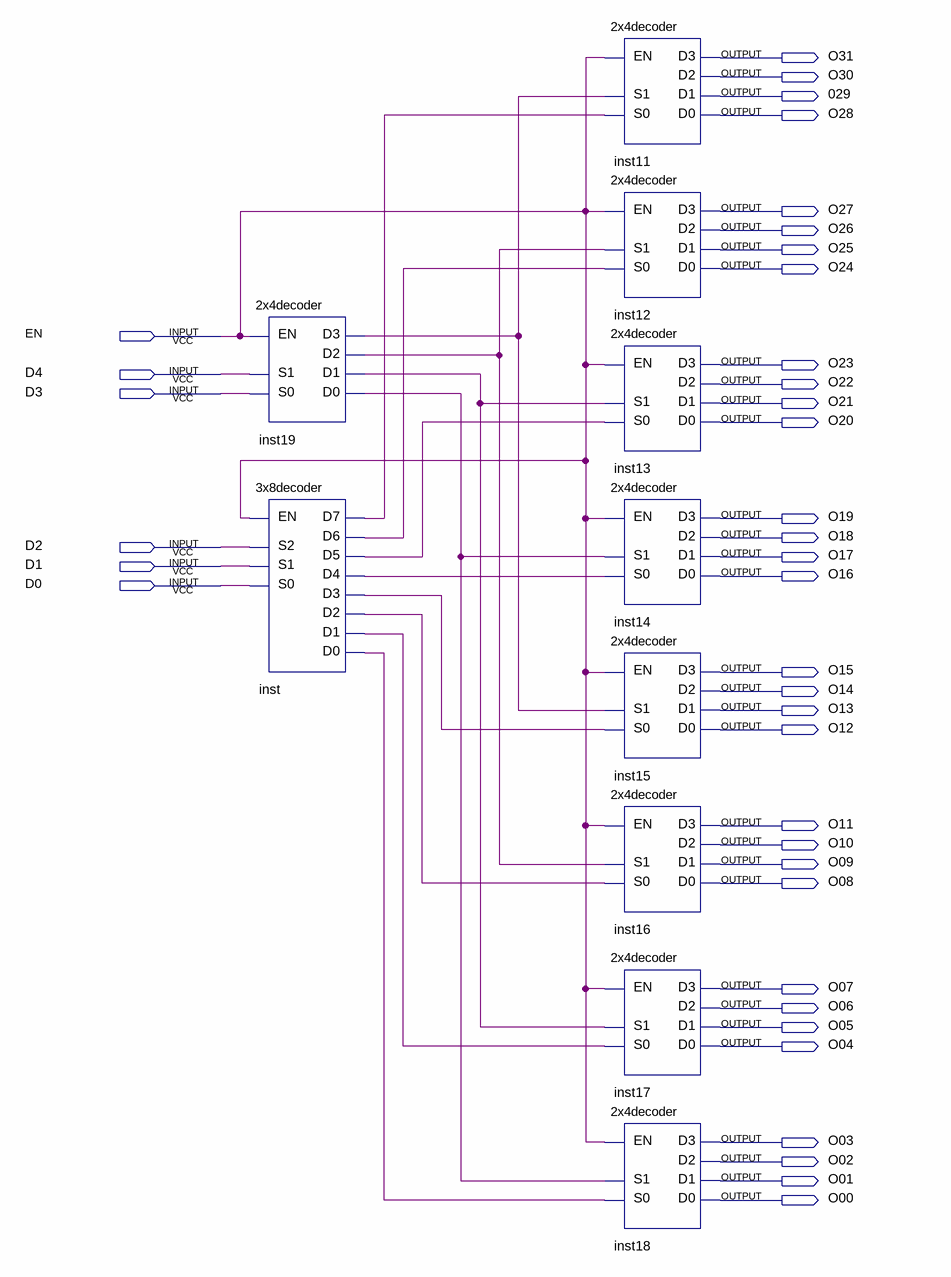
[diagram p0: schematic sheet]
// Quartus schematic hw6p1.bdf as structural Verilog: 10 symbols, 38 pins
module hw6p1 (
  input  EN,
  input  D4,
  input  D3,
  input  D2,
  input  D1,
  input  D0,
  output O31,
  output O30,
  output \029 ,
  output O28,
  output O27,
  output O26,
  output O25,
  output O24,
  output O23,
  output O22,
  output O21,
  output O20,
  output O19,
  output O18,
  output O17,
  output O16,
  output O15,
  output O14,
  output O13,
  output O12,
  output O11,
  output O10,
  output O09,
  output O08,
  output O07,
  output O06,
  output O05,
  output O04,
  output O03,
  output O02,
  output O01,
  output O00
);

  wire inst19_d0, inst19_d1, inst19_d2, inst19_d3, inst_d0, inst_d1, inst_d2, inst_d3, inst_d4, inst_d5,
       inst_d6, inst_d7;

  \2x4decoder  inst19 (.S1(D4), .S0(D3), .EN(EN), .D3(inst19_d3), .D2(inst19_d2), .D1(inst19_d1), .D0(inst19_d0));
  \3x8decoder  inst (
    .S2(D2), .S1(D1), .S0(D0), .EN(EN), .D7(inst_d7), .D6(inst_d6), .D5(inst_d5), .D4(inst_d4), .D3(inst_d3),
    .D2(inst_d2), .D1(inst_d1), .D0(inst_d0));
  \2x4decoder  inst11 (.S1(inst19_d3), .S0(inst_d7), .EN(EN), .D3(O31), .D2(O30), .D1(\029 ), .D0(O28));
  \2x4decoder  inst12 (.S1(inst19_d2), .S0(inst_d6), .EN(EN), .D3(O27), .D2(O26), .D1(O25), .D0(O24));
  \2x4decoder  inst13 (.S1(inst19_d1), .S0(inst_d5), .EN(EN), .D3(O23), .D2(O22), .D1(O21), .D0(O20));
  \2x4decoder  inst14 (.S1(inst19_d0), .S0(inst_d4), .EN(EN), .D3(O19), .D2(O18), .D1(O17), .D0(O16));
  \2x4decoder  inst15 (.S1(inst19_d3), .S0(inst_d3), .EN(EN), .D3(O15), .D2(O14), .D1(O13), .D0(O12));
  \2x4decoder  inst16 (.S1(inst19_d2), .S0(inst_d2), .EN(EN), .D3(O11), .D2(O10), .D1(O09), .D0(O08));
  \2x4decoder  inst17 (.S1(inst19_d1), .S0(inst_d1), .EN(EN), .D3(O07), .D2(O06), .D1(O05), .D0(O04));
  \2x4decoder  inst18 (.S1(inst19_d0), .S0(inst_d0), .EN(EN), .D3(O03), .D2(O02), .D1(O01), .D0(O00));
endmodule
